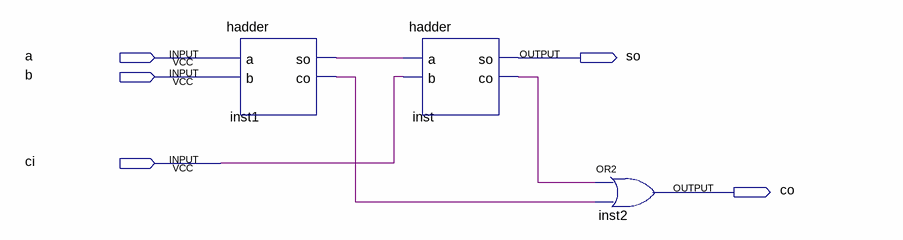
[diagram p0: schematic sheet]
// Quartus schematic fadder.bdf as structural Verilog: 3 symbols, 5 pins
module fadder (
  input  a,
  input  b,
  input  ci,
  output so,
  output co
);

  wire inst1_co, inst1_so, inst_co;

  hadder inst1 (.a(a), .b(b), .so(inst1_so), .co(inst1_co));
  hadder inst (.a(inst1_so), .b(ci), .so(so), .co(inst_co));
  or inst2 (co, inst_co, inst1_co);
endmodule
